# Altium schematic sheet 41_PP1_GND.SchDoc
size 419 x 296 mm; Author: Serbinov O.A.; CompanyName: ELSICOM; DrawnBy: Serbinov O.A.; Engineer: Serbinov O.A.; Organization: Elsicom; Address1: Kirova avenue, 58; Address2: Tomsk; Address3: Russia 634012; DocumentNumber: 42; SheetNumber: 42; SheetTotal: 44; ProjectName: 48_PORTS
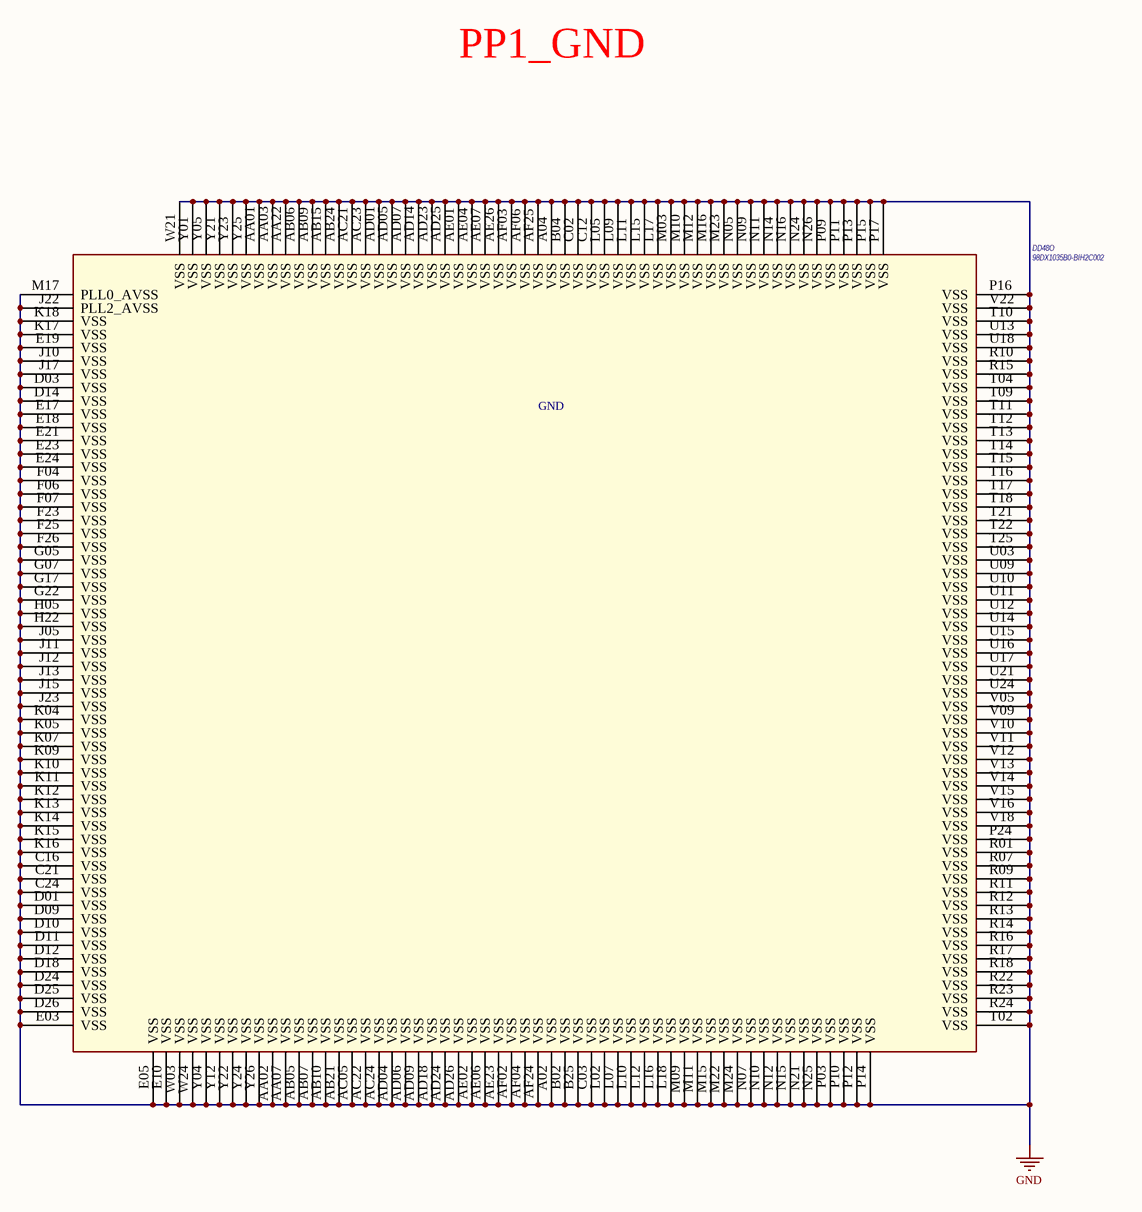
[diagram p0: 41_PP1_GND.SchDoc]

## Parts
DD48  98DX1035B0-BIH2C002  [HSBGA617_27X27_1MM]  (part O of 16)

## Nets
GND: DD48.A02(VSS) DD48.A04(VSS) DD48.AA01(VSS) DD48.AA02(VSS) DD48.AA03(VSS) DD48.AA07(VSS) DD48.AA22(VSS) DD48.AB05(VSS) DD48.AB06(VSS) DD48.AB07(VSS) DD48.AB09(VSS) DD48.AB10(VSS) DD48.AB15(VSS) DD48.AB21(VSS) DD48.AB24(VSS) DD48.AC05(VSS) DD48.AC21(VSS) DD48.AC22(VSS) DD48.AC23(VSS) DD48.AC24(VSS) DD48.AD01(VSS) DD48.AD04(VSS) DD48.AD05(VSS) DD48.AD06(VSS) DD48.AD07(VSS) DD48.AD09(VSS) DD48.AD14(VSS) DD48.AD18(VSS) DD48.AD23(VSS) DD48.AD24(VSS) DD48.AD25(VSS) DD48.AD26(VSS) DD48.AE01(VSS) DD48.AE02(VSS) DD48.AE04(VSS) DD48.AE06(VSS) DD48.AE07(VSS) DD48.AE23(VSS) DD48.AE26(VSS) DD48.AF02(VSS) DD48.AF03(VSS) DD48.AF04(VSS) DD48.AF06(VSS) DD48.AF24(VSS) DD48.AF25(VSS) DD48.B02(VSS) DD48.B04(VSS) DD48.B25(VSS) DD48.C02(VSS) DD48.C03(VSS) DD48.C12(VSS) DD48.C16(VSS) DD48.C21(VSS) DD48.C24(VSS) DD48.D01(VSS) DD48.D03(VSS) DD48.D09(VSS) DD48.D10(VSS) DD48.D11(VSS) DD48.D12(VSS) DD48.D14(VSS) DD48.D18(VSS) DD48.D24(VSS) DD48.D25(VSS) DD48.D26(VSS) DD48.E03(VSS) DD48.E05(VSS) DD48.E10(VSS) DD48.E17(VSS) DD48.E18(VSS) DD48.E19(VSS) DD48.E21(VSS) DD48.E23(VSS) DD48.E24(VSS) DD48.F04(VSS) DD48.F06(VSS) DD48.F07(VSS) DD48.F23(VSS) DD48.F25(VSS) DD48.F26(VSS) DD48.G05(VSS) DD48.G07(VSS) DD48.G17(VSS) DD48.G22(VSS) DD48.H05(VSS) DD48.H22(VSS) DD48.J05(VSS) DD48.J10(VSS) DD48.J11(VSS) DD48.J12(VSS) DD48.J13(VSS) DD48.J15(VSS) DD48.J17(VSS) DD48.J22(PLL2_AVSS) DD48.J23(VSS) DD48.K04(VSS) DD48.K05(VSS) DD48.K07(VSS) DD48.K09(VSS) DD48.K10(VSS) DD48.K11(VSS) DD48.K12(VSS) DD48.K13(VSS) DD48.K14(VSS) DD48.K15(VSS) DD48.K16(VSS) DD48.K17(VSS) DD48.K18(VSS) DD48.L02(VSS) DD48.L05(VSS) DD48.L07(VSS) DD48.L09(VSS) DD48.L10(VSS) DD48.L11(VSS) DD48.L12(VSS) DD48.L15(VSS) DD48.L16(VSS) DD48.L17(VSS) DD48.L18(VSS) DD48.M03(VSS) DD48.M09(VSS) DD48.M10(VSS) DD48.M11(VSS) DD48.M12(VSS) DD48.M15(VSS) DD48.M16(VSS) DD48.M17(PLL0_AVSS) DD48.M22(VSS) DD48.M23(VSS) DD48.M24(VSS) DD48.N05(VSS) DD48.N07(VSS) DD48.N09(VSS) DD48.N10(VSS) DD48.N11(VSS) DD48.N12(VSS) DD48.N14(VSS) DD48.N15(VSS) DD48.N16(VSS) DD48.N21(VSS) DD48.N24(VSS) DD48.N25(VSS) DD48.N26(VSS) DD48.P03(VSS) DD48.P09(VSS) DD48.P10(VSS) DD48.P11(VSS) DD48.P12(VSS) DD48.P13(VSS) DD48.P14(VSS) DD48.P15(VSS) DD48.P16(VSS) DD48.P17(VSS) DD48.P24(VSS) DD48.R01(VSS) DD48.R07(VSS) DD48.R09(VSS) DD48.R10(VSS) DD48.R11(VSS) DD48.R12(VSS) DD48.R13(VSS) DD48.R14(VSS) DD48.R15(VSS) DD48.R16(VSS) DD48.R17(VSS) DD48.R18(VSS) DD48.R22(VSS) DD48.R23(VSS) DD48.R24(VSS) DD48.T02(VSS) DD48.T04(VSS) DD48.T09(VSS) DD48.T10(VSS) DD48.T11(VSS) DD48.T12(VSS) DD48.T13(VSS) DD48.T14(VSS) DD48.T15(VSS) DD48.T16(VSS) DD48.T17(VSS) DD48.T18(VSS) DD48.T21(VSS) DD48.T22(VSS) DD48.T25(VSS) DD48.U03(VSS) DD48.U09(VSS) DD48.U10(VSS) DD48.U11(VSS) DD48.U12(VSS) DD48.U13(VSS) DD48.U14(VSS) DD48.U15(VSS) DD48.U16(VSS) DD48.U17(VSS) DD48.U18(VSS) DD48.U21(VSS) DD48.U24(VSS) DD48.V05(VSS) DD48.V09(VSS) DD48.V10(VSS) DD48.V11(VSS) DD48.V12(VSS) DD48.V13(VSS) DD48.V14(VSS) DD48.V15(VSS) DD48.V16(VSS) DD48.V18(VSS) DD48.V22(VSS) DD48.W03(VSS) DD48.W21(VSS) DD48.W24(VSS) DD48.Y01(VSS) DD48.Y04(VSS) DD48.Y05(VSS) DD48.Y12(VSS) DD48.Y21(VSS) DD48.Y22(VSS) DD48.Y23(VSS) DD48.Y24(VSS) DD48.Y25(VSS) DD48.Y26(VSS)

## Notes on the sheet
- PP1_GND
- A3
- SIZE
- PROJECT
- SHEET
- OF
- Engineer: Oleg Serbinov
- (in symbol 98DX1035A1-BIH2C002, part O) GND

## Library data of the parts
DD48 = 98DX1035A1-BIH2C002: IC 24-PORT FE  4-PORT 2.5GE L2 ENTRY-LEVEL, CPU; Customer Part Number: Микросхема, 98DX1035B0-BIH2C002, IC 24-PORT FE 4-PORT 2.5GE L2 ENTRY-LEVEL, HSBGA617SBGA617; Manufacturer: Marvell Technology Group; Manufacturer Part Number: 98DX1035B0-BIH2C002